# Altium schematic sheet Stm32F411CEU6.SchDoc
size A; SheetNumber: 9; SheetTotal: 12
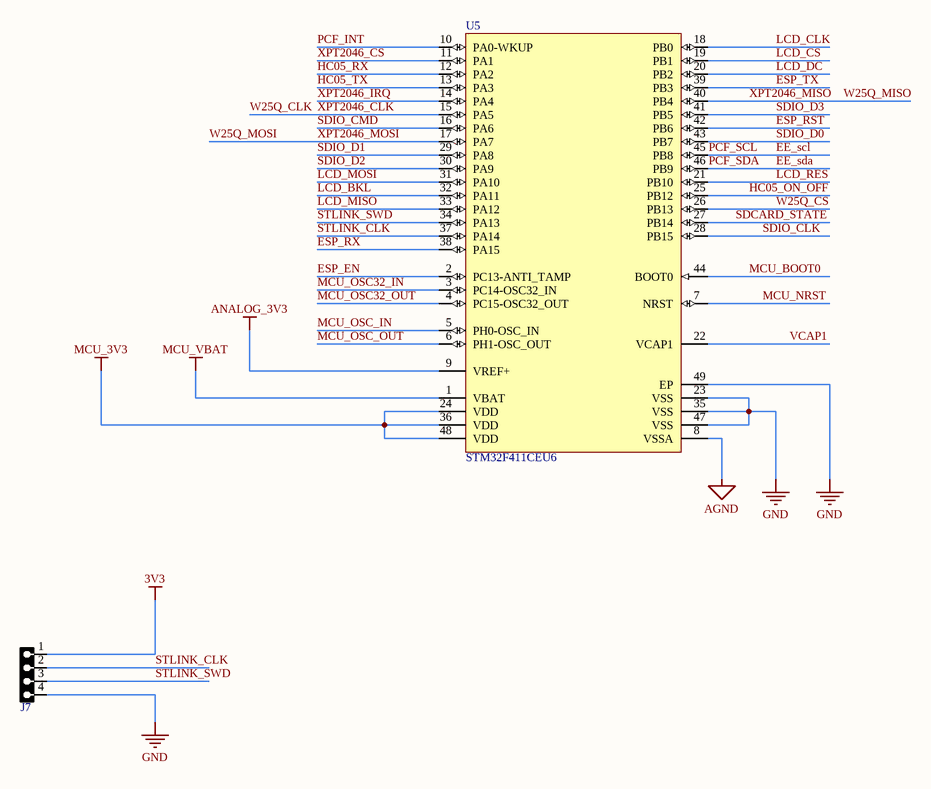
[diagram p0: Stm32F411CEU6.SchDoc]

## Parts
J7  HDRF4  [HDRSE_F_1X4]  (value not drawn)
U5  STM32F411CEU6  [STM-UFQFPN48_M]

## Nets
3V3: J7.1
AGND: U5.8(VSSA)
ANALOG_3V3: U5.9(VREF+)
GND: J7.4 U5.23(VSS) U5.35(VSS) U5.47(VSS) U5.49(EP)
MCU_3V3: U5.24(VDD) U5.36(VDD) U5.48(VDD)
MCU_VBAT: U5.1(VBAT)
EE_scl: U5.45(PB8)  [also labelled PCF_SCL]
EE_sda: U5.46(PB9)  [also labelled PCF_SDA]
ESP_EN: U5.2(PC13-ANTI_TAMP)
ESP_RST: U5.42(PB6)
ESP_RX: U5.38(PA15)
ESP_TX: U5.39(PB3)
HC05_ON_OFF: U5.25(PB12)
HC05_RX: U5.12(PA2)
HC05_TX: U5.13(PA3)
LCD_BKL: U5.32(PA11)
LCD_CLK: U5.18(PB0)
LCD_CS: U5.19(PB1)
LCD_DC: U5.20(PB2)
LCD_MISO: U5.33(PA12)
LCD_MOSI: U5.31(PA10)
LCD_RES: U5.21(PB10)
MCU_BOOT0: U5.44(BOOT0)
MCU_NRST: U5.7(NRST)
MCU_OSC32_IN: U5.3(PC14-OSC32_IN)
MCU_OSC32_OUT: U5.4(PC15-OSC32_OUT)
MCU_OSC_IN: U5.5(PH0-OSC_IN)
MCU_OSC_OUT: U5.6(PH1-OSC_OUT)
PCF_INT: U5.10(PA0-WKUP)
SDCARD_STATE: U5.27(PB14)
SDIO_CLK: U5.28(PB15)
SDIO_CMD: U5.16(PA6)
SDIO_D0: U5.43(PB7)
SDIO_D1: U5.29(PA8)
SDIO_D2: U5.30(PA9)
SDIO_D3: U5.41(PB5)
STLINK_CLK: J7.2 U5.37(PA14)
STLINK_SWD: J7.3 U5.34(PA13)
VCAP1: U5.22(VCAP1)
W25Q_CLK: U5.15(PA5)  [also labelled XPT2046_CLK]
W25Q_CS: U5.26(PB13)
W25Q_MISO: U5.40(PB4)  [also labelled XPT2046_MISO]
W25Q_MOSI: U5.17(PA7)  [also labelled XPT2046_MOSI]
XPT2046_CS: U5.11(PA1)
XPT2046_IRQ: U5.14(PA4)

## Library data of the parts
J7 = HDRSE_F_1X4: CONN, HEADER, Female, pitch: 2.54mm, 4POS; VALUE: HDRF4
U5 = CMP-0243-00165-1: ARM Cortex-M4 32-bit MCU+FPU, 512 KB Flash, 128 KB RAM, 36 I/Os, 48-Pin UFQFPN, -40 to 85 degC, Tray; Operating Frequency(F) (Processor speed) (MHz): 100; FLASH Size (Prog) (kB): 512; Internal RAM Size (kB): 128; I/Os (High Current): 36; Supply Voltage(Vcc) min (V): 1.7; Package Reference: 48-Pin Ultra Thin Fine Pitch Quad Flat No-Lead, 7 x 7 x 0.6 mm Body, 0.5 mm Pitch, Exposed Pad; ComponentLink1Description: Manufacturer URL; ComponentLink1URL: http://www.st.com/; Packing: Tray; Package Description: UFQFPN48; Core: ARM Cortex-M4; ComponentLink2Description: Datasheet; ComponentLink2URL: http://www.st.com/st-web-ui/static/active/en/resource/technical/document/datasheet/DM00115249.pdf; DatasheetVersion: Rev. 6; Mounting Technology: Surface Mount